# EAGLE design jlpcb-105 (EAGLE 5.10)
ABBREV: jn5; PROJECT: JeeNode v5
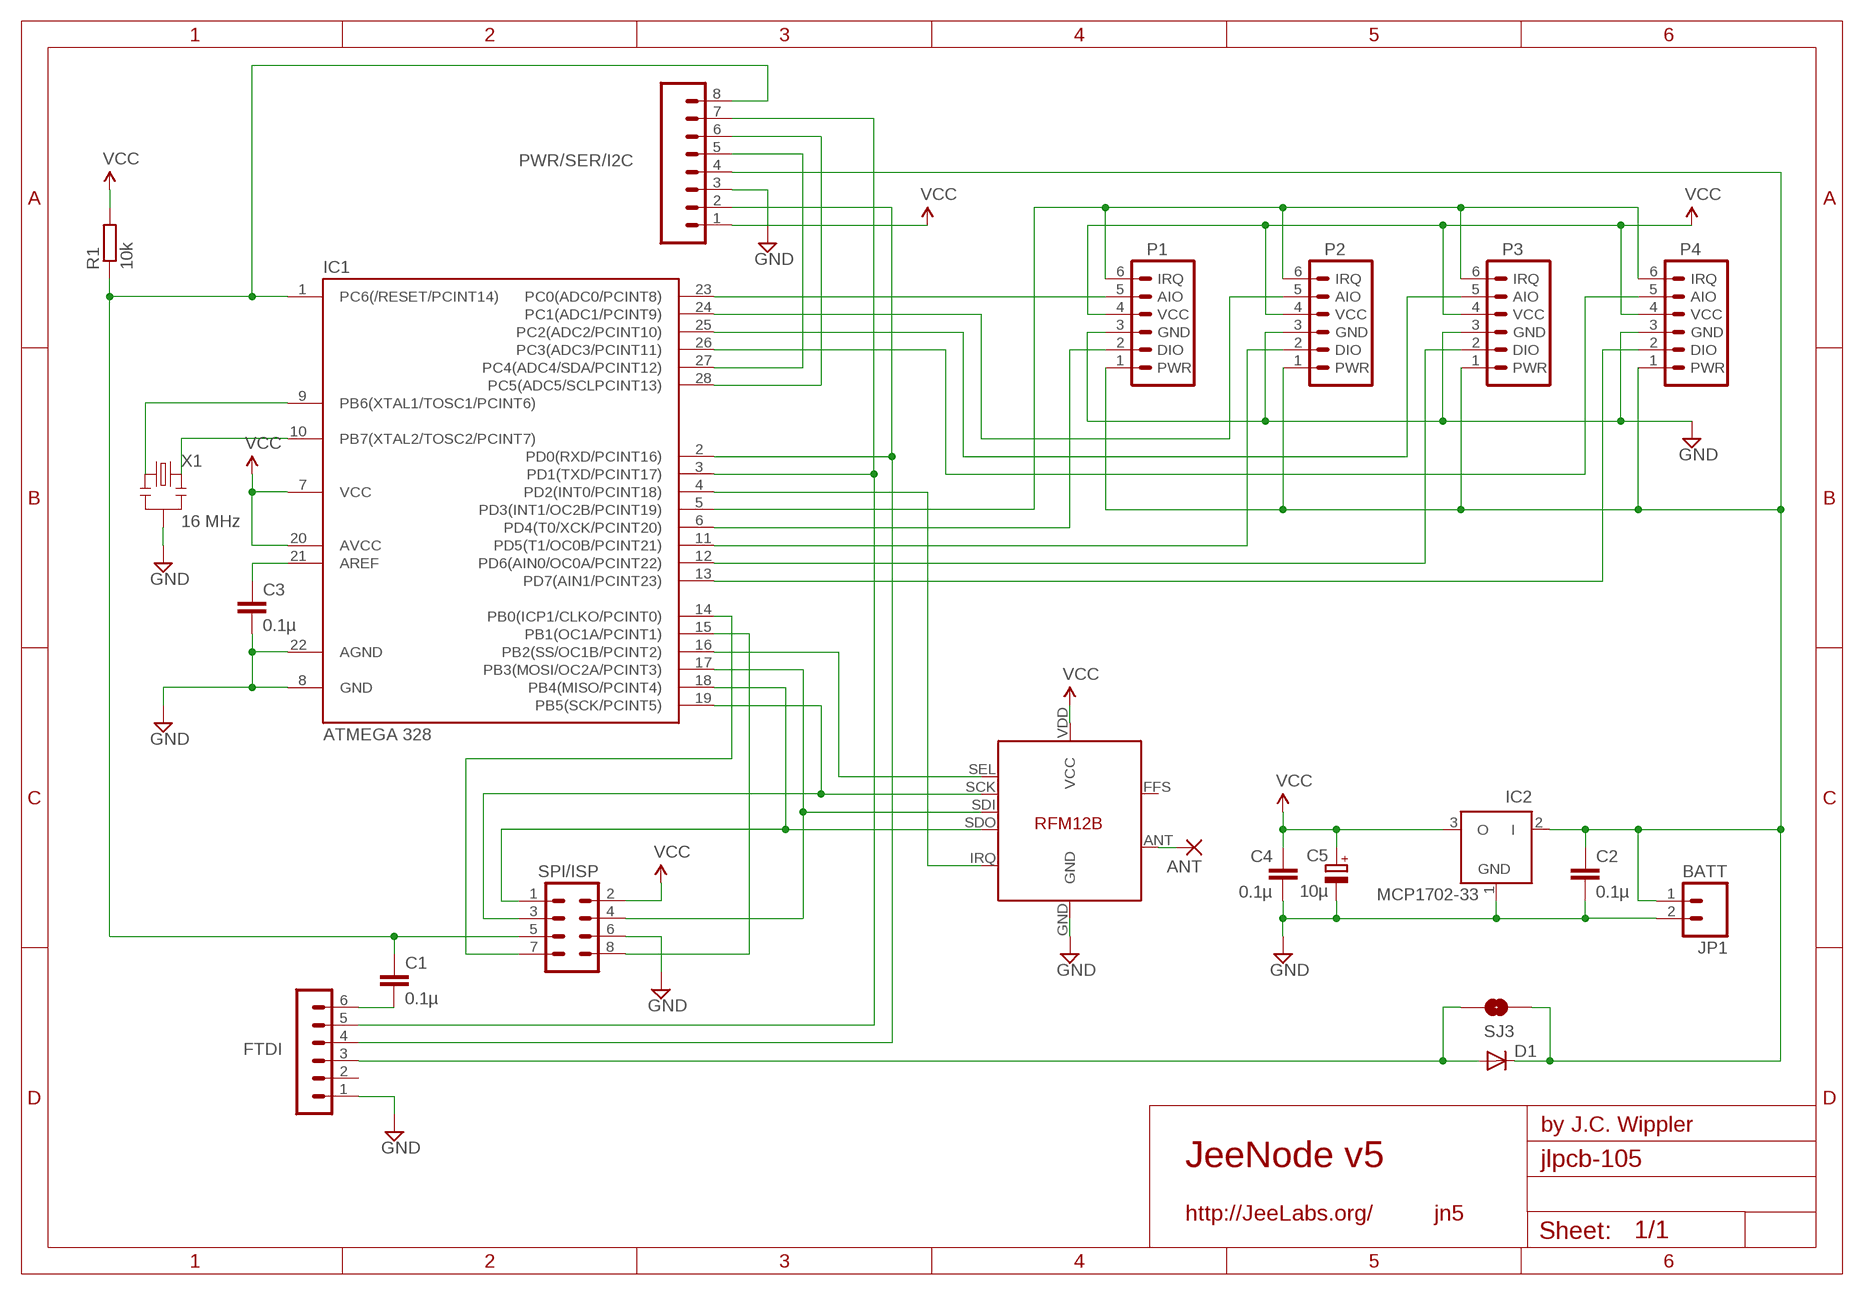
[diagram p0: schematic, sheet 1]

## Parts
ANT  1,6/0,8  [1,6/0,8]
C1  0.1µ  C-EU025-024X044  [C025-024X044]
C2  0.1µ  C-EU025-024X044  [C025-024X044]
C3  0.1µ  C-EU025-024X044  [C025-024X044]
C4  0.1µ  C-EU025-024X044  [C025-024X044]
C5  10µ  CPOL-EUE1.8-4  [E1,8-4]
D1  DIODE-D-5  [D-5]
FTDI  FTDI  MA06-1  [MA06-1]
IC1  ATMEGA 328  ATMEGA48/88/168-PU  [DIL28-3]
IC2  MCP1702-33  MCP1702Z  [TO92]
JP1  BATT  M02LOCK_LONGPADS  [1X02_LOCK_LONGPADS]
P1  JEEPORT  JEEPORT-FEMALE  [1X06_FEMALE_LOCK.010]
P2  JEEPORT  JEEPORT-FEMALE  [1X06_FEMALE_LOCK.010]
P3  JEEPORT  JEEPORT-FEMALE  [1X06_FEMALE_LOCK.010]
P4  JEEPORT  JEEPORT-FEMALE  [1X06_FEMALE_LOCK.010]
PWR/SER/I2C  M08  [1X08]
R1  10k  R-EU_0204/7  [0204/7]
SJ3  SOLDERJUMPERNO  [SJ_2S-NO]
SV7  SPI/ISP  MA04-2  [MA04-2]
U$1  RFM12B  [RFM12B]
X1  16 MHz  RESONATORPTH  [RESONATOR-PTH]

## Nets
A0: IC1.23(PC0(ADC0/PCINT8)) P1.5(AIO)
A1: IC1.24(PC1(ADC1/PCINT9)) P2.5(AIO)
A2: IC1.25(PC2(ADC2/PCINT10)) P3.5(AIO)
A3: IC1.26(PC3(ADC3/PCINT11)) P4.5(AIO)
GND [power]: C2.2 C3.2 C4.2 C5.- FTDI.1 IC1.8(GND) IC1.22(AGND) IC2.1(GND) JP1.2 P1.3(GND) P2.3(GND) P3.3(GND) P4.3(GND) PWR/SER/I2C.3 SV7.6 U$1.GND X1.2
INT2: IC1.5(PD3(INT1/OC2B/PCINT19)) P1.6(IRQ) P2.6(IRQ) P3.6(IRQ) P4.6(IRQ)
N$1: IC1.9(PB6(XTAL1/TOSC1/PCINT6)) X1.1
N$2: IC1.18(PB4(MISO/PCINT4)) SV7.1 U$1.SDO
N$3: IC1.17(PB3(MOSI/OC2A/PCINT3)) SV7.4 U$1.SDI
N$4: IC1.16(PB2(SS/OC1B/PCINT2)) U$1.SEL
N$5: IC1.19(PB5(SCK/PCINT5)) SV7.3 U$1.SCK
N$6: IC1.15(PB1(OC1A/PCINT1)) SV7.8
N$7: IC1.4(PD2(INT0/PCINT18)) U$1.IRQ
N$8: IC1.6(PD4(T0/XCK/PCINT20)) P1.2(DIO)
N$9: IC1.11(PD5(T1/OC0B/PCINT21)) P2.2(DIO)
N$10: IC1.12(PD6(AIN0/OC0A/PCINT22)) P3.2(DIO)
N$11: IC1.13(PD7(AIN1/PCINT23)) P4.2(DIO)
N$12 [power]: D1.A FTDI.3 SJ3.2
N$13: ANT.1(P) U$1.ANT
N$19: C3.1 IC1.21(AREF)
N$20: C1.2 FTDI.6
N$21: IC1.10(PB7(XTAL2/TOSC2/PCINT7)) X1.3
N$22: IC1.14(PB0(ICP1/CLKO/PCINT0)) SV7.7
N$24: IC1.28(PC5(ADC5/SCLPCINT13)) PWR/SER/I2C.6
N$25: IC1.27(PC4(ADC4/SDA/PCINT12)) PWR/SER/I2C.5
PWR [power]: C2.1 D1.C IC2.2(I) JP1.1 P1.1(PWR) P2.1(PWR) P3.1(PWR) P4.1(PWR) PWR/SER/I2C.4 SJ3.1
RST: C1.1 IC1.1(PC6(/RESET/PCINT14)) PWR/SER/I2C.8 R1.1 SV7.5
RXD: FTDI.4 IC1.2(PD0(RXD/PCINT16)) PWR/SER/I2C.2
TXD: FTDI.5 IC1.3(PD1(TXD/PCINT17)) PWR/SER/I2C.7
VCC [power]: C4.1 C5.+ IC1.7(VCC) IC1.20(AVCC) IC2.3(O) P1.4(VCC) P2.4(VCC) P3.4(VCC) P4.4(VCC) PWR/SER/I2C.1 R1.2 SV7.2 U$1.VDD(VCC)
Unconnected: FTDI.2 U$1.FFS

## Library data of the parts
ANT = JeeLabs:1,6/0,8: THROUGH-HOLE PAD
C1-C4 = resistor:C-EU: CAPACITOR, European symbol
C5 = resistor:CPOL-EU: POLARIZED CAPACITOR, European symbol
D1 = diode:DIODE-: DIODE
FTDI = JeeLabs:MA06-1: PIN HEADER
IC1 = atmega8:ATMEGA48/88/168-PU
IC2 = JeeLabs:MCP1702: 200 mA, Low Power Low Dropout Voltage Regulator
JP1 = SparkFun:M02: Header 2 Standard 2-pin 0.1" header. Use with straight break away headers (SKU : PRT-00116), right angle break away headers (PRT-00553), swiss pins (PRT-00743), machine pins (PRT-00117), and female headers (PRT-00115). Molex polarized connector foot print use with SKU : PRT-08233 with associated crimp pins and housings.
P1-P4 = JeeLabs:JEEPORT: PIN HEADER
PWR/SER/I2C = SparkFun:M08: Header 8 Standard 8-pin 0.1" header. Use with straight break away headers (SKU : PRT-00116), right angle break away headers (PRT-00553), swiss pins (PRT-00743), machine pins (PRT-00117), and female headers (PRT-00115).
R1 = resistor:R-EU_: RESISTOR, European symbol
SJ3 = SparkFun:SOLDERJUMPER: Solder Jumper Standard SMD solder jumper. Used to automate production. Two varients : Normally Open and Normally Closed are the same, but have different paste layers. NC will have a large amount of paste and should jumper during reflow.
SV7 = JeeLabs:MA04-2: PIN HEADER
U$1 = JeeLabs:RFM12B
X1 = SparkFun:RESONATOR: Resonator Small SMD resonator. This is the itty bitty 10/20MHz resonators with built in caps. CSTCE10M0G55 and CSTCE20M0V53. Footprint has been reviewed closely but hasn't been tested yet.

## Net classes
1 power: width 0.381 mm, clearance 0.254 mm

## Board
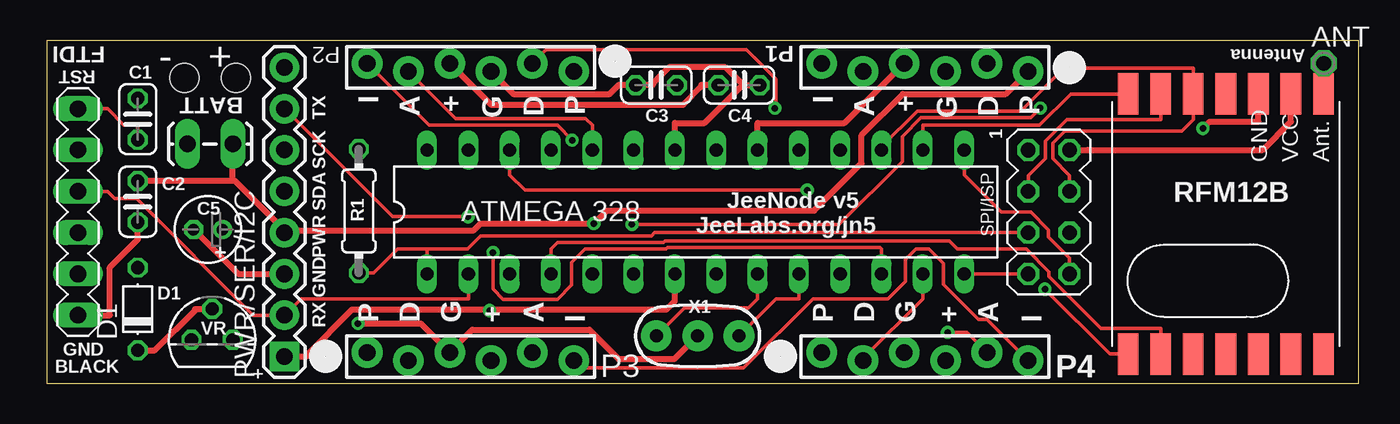
[diagram p1: board, top side]
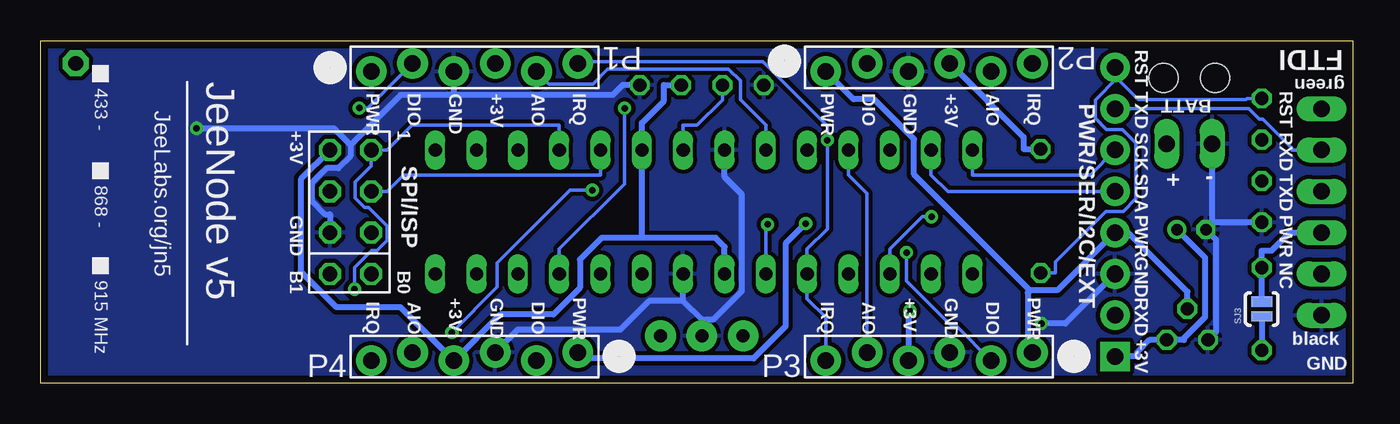
[diagram p2: board, bottom side, seen from below]

Size 80.64 x 21.08 mm. Coordinates in mm from the lower left corner, seen from the top.
Outline: 0,0 80.64,0 80.64,21.08 0,21.08 0,0
Copper layers (1*16): Top 0.035mm / dielectric 1.5mm / Bottom 0.035mm
Design rules "10mils *": minimum track width 8mil, minimum drill 0.4mm, track to track 8mil, track to pad 8mil, pad to pad 8mil, via to via 8mil, smd to smd 8mil, copper to edge 18mil, drill to drill 0.4mm, minimum pad ring 0.15mm, minimum via ring 8mil, stop-mask expansion 4mil, vias tented up to drill 20mil, thermal gap 10mil
Holes 1.78 mm at 8.45,18.8 11.62,18.8

### Footprints (pad centres in the part's own frame; a part is rotated, then mirrored left to right if it is on the bottom)
1,6/0,8 = drill 0.9 pad 1.6 octagon: 1 0,0
C025-024X044 = drill 0.813 octagon: 1 -1.27,0; 2 1.27,0
E1,8-4 = drill 0.711 pad 1.168 round: + -0.889,0 | drill 0.711 pad 1.168 octagon: - 0.889,0
D-5 = drill 0.813 octagon: A 2.54,0; C -2.54,0
MA06-1 = drill 1.016 long: 1 0,0; 2 2.54,0; 3 5.08,0; 4 7.62,0; 5 10.16,0; 6 12.7,0
DIL28-3 = drill 0.813 long: 1 -16.51,-3.81; 2 -13.97,-3.81; 3 -11.43,-3.81; 4 -8.89,-3.81; 5 -6.35,-3.81; 6 -3.81,-3.81; 7 -1.27,-3.81; 8 1.27,-3.81; 9 3.81,-3.81; 10 6.35,-3.81; 11 8.89,-3.81; 12 11.43,-3.81; 13 13.97,-3.81; 14 16.51,-3.81; 15 16.51,3.81; 16 13.97,3.81; 17 11.43,3.81; 18 8.89,3.81; 19 6.35,3.81; 20 3.81,3.81; 21 1.27,3.81; 22 -1.27,3.81; 23 -3.81,3.81; 24 -6.35,3.81; 25 -8.89,3.81; 26 -11.43,3.81; 27 -13.97,3.81; 28 -16.51,3.81
TO92 = drill 0.813 octagon: 1 -1.27,0; 2 0,1.905; 3 1.27,0
1X02_LOCK_LONGPADS = drill 1.016 long: 1 -0.127,0; 2 2.667,0
1X06_FEMALE_LOCK.010 = drill 1.016 pad 1.88 round: 1 0,0.254; 2 2.54,-0.254; 3 5.08,0.254; 4 7.62,-0.254; 5 10.16,0.254; 6 12.7,-0.254
1X08 = drill 1.016 pad 1.829 square: 1 0,0 | drill 1.016 pad 1.829 round: 2 2.54,0; 3 5.08,0; 4 7.62,0; 5 10.16,0; 6 12.7,0; 7 15.24,0; 8 17.78,0
0204/7 = drill 0.813 octagon: 1 -3.81,0; 2 3.81,0
SJ_2S-NO = smd 0.635 x 1.27: 1 -0.45,0; 2 0.45,0
MA04-2 = drill 0.9 octagon: 1 -3.81,-1.27; 2 -3.81,1.27; 3 -1.27,-1.27; 4 -1.27,1.27; 5 1.27,-1.27; 6 1.27,1.27; 7 3.81,-1.27; 8 3.81,1.27
RFM12B = smd 2.54 x 1.27: ANT 8,-6; FFS -8,2; GND 8,-2; IRQ -8,4; P$8 -8,0; P$9 -8,-2; P$10 -8,-4; P$12 -8,-6; P$16 8,0; SCK 8,4; SDI 8,2; SDO -8,6; SEL 8,6; VDD 8,-4
RESONATOR-PTH = drill 0.8 pad 1.88 round: 1 -2.54,0; 2 0,0; 3 2.54,0

### Placement (x,y rotation side)
ANT  78.49,19.69 0 top
C1  5.59,16.26 270 top
C2  5.59,11.18 270 top
C3  37.47,18.35 180 top
C4  42.55,18.35 0 top
C5  9.91,9.46 180 top
D1  5.59,4.57 90 top
FTDI  1.91,4.19 90 top
IC1  39.88,10.54 0 top
IC2  10.16,2.67 0 top
JP1  11.3,14.73 180 top
P1  60.33,19.43 180 top
P2  32.39,19.43 180 top
P3  19.68,1.65 0 top
P4  47.62,1.65 0 top
PWR/SER/I2C  14.61,1.65 90 top
R1  19.18,10.6 90 top
SJ3  5.59,4.57 90 bottom
SV7  61.59,10.54 270 top
U$1  72.47,9.8 90 top
X1  40.01,2.92 0 top

### Tracks (layer width: path | path; a pad name or v marks a point on that pad's centre or on a via)
A0
  Bottom 0.203: P1.5 49.41,18.42 46.7,18.42 45.8,19.32 38.36,19.32 37.64,18.61 37.64,17.45 36.07,15.88 IC1.23
A1
  Top 0.203: P2.5 25.12,16.28 33.12,16.28 33.53,15.88 IC1.24
A2
  Bottom 0.203: P3.5 29.84,11.68 30.99,12.83 IC1.25
A3  (via drill 0.4 pad 0.81)
  Top 0.203: IC1.26 28.45,12.83 29.39,11.88 v46.74,11.88 | P4.5 56.56,3.13 v55.37,3.13
  Bottom 0.203: v55.37,3.13 52.58,5.92 52.58,7.4 48.09,11.88 v46.74,11.88
GND  (via drill 0.4 pad 0.81)
  Top 0.381: U$1.GND 74.47,16.09 71.46,16.09 v71.06,15.69 | PWR/SER/I2C.3 11.75,6.73 C5.- | v19.12,3.68 22.98,3.68 P3.3 26.15,3.29 33.34,3.29 35.14,1.49 38.58,1.49 X1.2 | 42.79,18.37 41.71,19.45 38.24,19.45 37.25,18.46 37.25,18.35 C3.2 35.14,18.35 34.55,17.76 28.72,17.76 P2.3 | 42.79,18.37 42.81,18.35 43.29,18.35 C4.2 | 42.79,18.37 40.43,16.02 38.61,16.02 IC1.22 | C2.2 5.59,8.85 3.87,7.14 3.87,4.19 FTDI.1
  Bottom 0.381: P4.3 51.32,3.29 45.03,3.29 43.25,5.07 41.15,5.07 | 41.15,5.07 IC1.8 | 40.01,3.92 41.15,5.07 | 40.01,3.92 39.3,3.92 37.54,5.68 37.54,11.62 38.61,12.69 IC1.22 | X1.2 40.01,3.92 | 61.59,14.66 62.62,15.69 v71.06,15.69 | 61.59,14.66 58.52,17.74 55.25,17.74 | 61.59,14.66 61.59,13.98 62.35,13.23 63.07,13.23 63.99,12.31 63.99,11.23 63.15,10.39 62.87,10.39 SV7.6 | 8.64,9.91 8.64,9.84 C5.- 8.4,8.85 8.4,3.15 IC2.1 | 8.64,9.91 8.64,12.76 JP1.2 | 8.64,9.91 6.64,9.91 C2.2 | 55.25,17.74 45.48,17.74 44.87,18.35 C4.2 | 55.25,17.74 P1.3 | PWR/SER/I2C.3 17.65,3.68 v19.12,3.68
  pour Bottom: 0,21.08 80.64,21.08 80.64,0 0,0
INT2  (via drill 0.4 pad 0.81)
  Top 0.203: P3.6 32.83,0.95 42.82,0.95 47.08,5.21 51.69,5.21 52.76,6.28 52.76,7.62 53.41,8.26 54.23,8.26 55.12,7.37 55.12,6.09 57.27,3.94 57.78,3.94 P4.6 | 23.49,15.88 P2.6 | 23.49,15.88 | 23.49,15.88 31.38,15.88 v32.29,14.96
  Bottom 0.203: P3.6 32.39,4.06 33.53,5.21 IC1.5 33.53,7.19 33.53,8.26 32.29,9.49 v32.29,14.96 32.29,15.82 36.24,19.77 47.54,19.77 P1.6
N$1
  Top 0.203: IC1.9 43.69,5.21 43.12,4.64 39.18,4.64 X1.1
N$2  (via drill 0.4 pad 0.81)
  Top 0.203: U$1.SDO 65.34,1.8 v61.35,5.79
  Bottom 0.203: v61.35,5.79 61.35,7.13 60.31,8.17 59.95,8.17 59.34,8.78 59.34,9.68 60.49,10.83 60.74,10.83 61.31,11.4 61.31,12.38 60.33,13.37 SV7.1 59.34,14.35 57.82,15.88 48.77,15.88 IC1.18
N$3
  Top 0.203: IC1.17 51.31,14.57 53.5,16.76 59.88,16.76 62.5,19.38 70.47,19.38 U$1.SDI 70.47,17.12 70.47,16.23 69.76,15.52 62.57,15.52 61.83,14.77 61.83,13.83 62.87,12.79 SV7.4
N$4
  Top 0.203: U$1.SEL 62.93,17.8 61,15.88 53.85,15.88 IC1.16
N$5
  Top 0.203: SV7.3 60.33,12.79 61.36,13.83 61.36,14.91 62.69,16.23 68.47,16.23 U$1.SCK
  Bottom 0.203: SV7.3 59.34,11.81 58.33,12.83 46.23,12.83 IC1.19
N$6
  Top 0.203: IC1.15 56.39,12.83 58.67,10.54 60.48,10.54 61.57,9.45 61.57,9.01 62.87,7.71 SV7.8
N$7
  Top 0.203: IC1.4 30.99,8.26 31.39,8.66 37.9,8.66 37.99,8.76 55.47,8.76 55.97,8.26 60.2,8.26 61.59,6.86 61.59,6.58 64.8,3.38 68.47,3.38 U$1.IRQ
N$8  (via drill 0.4 pad 0.81)
  Top 0.203: v61.06,16.94 60.48,16.35 53.74,16.35 52.58,15.19 52.58,13.66 48.7,9.78 v35.96,9.78
  Bottom 0.203: IC1.6 36.07,9.67 v35.96,9.78 | P1.2 60.54,16.94 v61.06,16.94
N$9  (via drill 0.4 pad 0.81)
  Top 0.203: P2.2 30.68,20.52 43.01,20.52 44.81,18.73 44.81,16.98 v44.75,16.92
  Bottom 0.203: IC1.11 48.77,8.26 44.75,12.28 v44.75,16.92
N$10  (via drill 0.4 pad 0.81)
  Top 0.203: v27.42,8.05 27.42,5.8 28.05,5.17 31.39,5.17 32.26,6.04 32.26,7.42 33.09,8.26 38.06,8.26 38.16,8.35 51.21,8.35 51.31,8.26 IC1.12
  Bottom 0.203: P3.2 24.34,3.51 24.62,3.51 27.42,6.31 v27.42,8.05
N$11
  Top 0.203: P4.2 50.16,1.52 53.85,5.21 IC1.13
N$12
  Bottom 0.381: SJ3.2 D1.A 5.59,8.17 4.98,8.17 3.87,9.27 FTDI.3
N$13
  Top 0.203: U$1.ANT 78.47,19.38 78.49,19.4 ANT.1
N$19
  Bottom 0.203: IC1.21 41.15,15.88 40.3,15.88 38.73,17.44 C3.1
N$20
  Top 0.203: C1.2 5.59,15.9 4.72,15.9 3.73,16.89 FTDI.6
N$21
  Top 0.203: IC1.10 46.23,5.21 44.83,5.21 X1.3
N$22
  Top 0.203: IC1.14 SV7.7
N$24
  Bottom 0.203: IC1.28 23.37,12.83 16.13,12.83 PWR/SER/I2C.6
N$25
  Bottom 0.203: IC1.27 25.91,12.83 24.89,11.81 PWR/SER/I2C.5
PWR  (via drill 0.4 pad 0.81)
  Top 0.381: P1.1 58.94,17.79 52.61,17.79 50.08,15.26 50.08,13.54 47.17,10.62 34.42,10.62 v33.62,9.83 26.66,9.83 26.23,9.4 14.61,9.4 | IC2.2 9.11,4.57 9.11,4.5 6.64,2.03 D1.C | 14.61,9.4 11.56,12.45 11.43,12.45 | PWR/SER/I2C.4 14.61,9.4 | 11.43,12.45 JP1.1 | 11.43,12.45 6.64,12.45 C2.1
  Bottom 0.381: P4.1 47.25,1.53 36.83,1.53 34.85,3.51 34.85,8.6 v33.62,9.83 | P3.1 19.97,2.19 19.97,5.57 19.83,5.72 | IC2.2 10.16,5.63 13.8,9.27 PWR/SER/I2C.4 18.16,5.72 19.83,5.72 | 19.83,5.72 26.96,12.85 26.96,15.02 29.42,17.47 30.68,17.47 P2.1 | SJ3.1 D1.C
RST
  Top 0.203: 23.37,8.26 25.86,8.26 26.67,9.07 37.15,9.07 37.36,9.27 59.34,9.27 SV7.5 | R1.1 20.09,6.79 21.55,8.26 23.37,8.26 | 23.37,8.26 IC1.1
  Bottom 0.203: 14.49,18.76 13.18,17.46 6.57,17.46 6.5,17.53 C1.1 | PWR/SER/I2C.8 14.61,18.88 14.49,18.76 | 14.49,18.76 15.83,17.43 15.83,16.32 15.12,15.62 14.15,15.62 13.31,14.79 13.31,11.36 14.1,10.58 15.17,10.58 18.26,7.48 18.26,6.79 R1.1
RXD
  Top 0.203: FTDI.4 3.73,11.81 4.18,11.37 5.52,11.37 12.69,4.19 PWR/SER/I2C.2 15.62,5.21 25.91,5.21 IC1.2
TXD  (via drill 0.4 pad 0.81)
  Top 0.203: PWR/SER/I2C.7 21.24,10.25 v25.88,10.25
  Bottom 0.203: IC1.3 28.45,8.26 26.45,10.25 v25.88,10.25 | FTDI.5 3.73,14.35 3.73,14.46 5.53,16.26 5.74,16.26 6.38,16.89 PWR/SER/I2C.7
VCC  (via drill 0.4 pad 0.81)
  Top 0.381: SV7.2 63.99,14.35 74.73,14.35 76.47,16.09 U$1.VDD | 27.22,4.54 38.08,4.54 38.61,5.07 IC1.7 | 27.22,4.54 18.76,4.54 15.96,1.74 15.96,1.65 PWR/SER/I2C.1 | 27.22,4.54 v27.22,4.47 | P1.4 49.04,16.02 43.69,16.02 IC1.20 | C4.1 40.22,18.35 40.22,18.24 39.1,17.13 27.32,17.13 P2.4
  Bottom 0.381: SV7.2 64.62,12.59 64.62,6.84 62.46,4.67 58.52,4.67 P4.4 52.4,4.24 49.13,4.24 47.5,5.88 47.5,7.61 46.16,8.95 43.69,8.95 | v27.22,4.47 27.3,4.39 P3.4 | R1.2 20.23,14.41 20.23,15.15 P2.4 | C5.+ 9.06,7.73 9.06,4.08 10.38,2.77 10.38,2.67 IC2.3 12.48,2.67 13.25,1.91 13.25,1.65 PWR/SER/I2C.1 | 43.69,8.95 39.16,8.95 38.61,8.4 IC1.7 | 43.69,8.95 43.69,12.69 IC1.20 43.69,16.02 42.33,17.37 42.33,18.35 C4.1

### Text on the board
_tsilk: FTDI | P1 | Antenna | RST | C1 | - | + | TX | I | A | + | G | D | P | I | A | + | G | D | P | C3 | C4 | SCK | 1 | SDA | C2 | JeeNode v5 | RFM12B | C5 | PWR | R1 | JeeLabs.org/jn5 | GND | D1 | RX | P | D | G | + | A | I | X1 | P | D | G | + | A | I | VR | GND | BLACK | + | P4
_bsilk: P2 | P1 | FTDI | RST | green | RST | TXD | IRQ | AIO | +3V | GND | DIO | PWR | IRQ | AIO | +3V | GND | DIO | PWR | JeeNode v5 | 433 - | BATT | PWR/SER/I2C/EXT | JeeLabs.org/jn5 | RXD | SCK | 1 | +3V | TXD | - | + | SDA | SPI/ISP | 868 - | PWR | PWR | GND | GND | NC | B0 | B1 | 915 MHz | RXD | PWR | DIO | GND | +3V | AIO | IRQ | PWR | DIO | GND | +3V | AIO | IRQ | +3V | black | GND | P3 | P4